# EAGLE design sliding protentiometer (EAGLE 6.1)
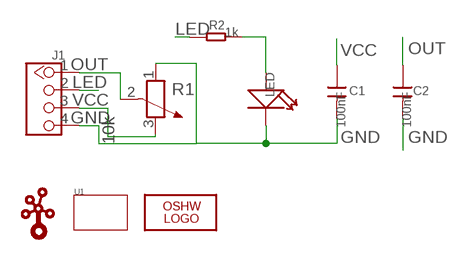
[diagram p0: schematic, sheet 1]

## Parts
C1  100nF  C-0805  [0805]
C2  100nF  C-0805  [0805]
J1  TWIG-4P-2.0-2.0  [4P-2.0]
LED  LED'0805'  [LED-0805]
LOGO1  LOGO-OSHW-FILLX0200-NT  [OSHW_FILLX200_NOTEXT]
R1  10k  R-POTENTIOMETER  [3P-SQUA-45.6X10X5.8H]
R2  1k  R-0805  [0805]
U1  TWIG'3U'  [3U-DIM-W/-DRILL]
U$1  LOGO-TWIG  [TWIGLOGO]

## Nets
GND: C1.2 C2.2 J1.4 LED.- R1.1
LED: J1.2 R2.1
N$5: LED.+ R2.2
OUT: C2.1 J1.1 R1.2
VCC: C1.1 J1.3 R1.3

## Library data of the parts
C1 C2 = Discrete:C*: Ceramic Capacitors
J1 = Connector:TWIG-4P-2.0
LED = Discrete:LED*
LOGO1 = Logo:LOGO-OSHW-FILL
R1 = Discrete:R-POTENTIOMETER*: Potentiometer
R2 = Discrete:R*
U1 = Module:TWIG
U$1 = Logo:LOGO-TWIG

## Board
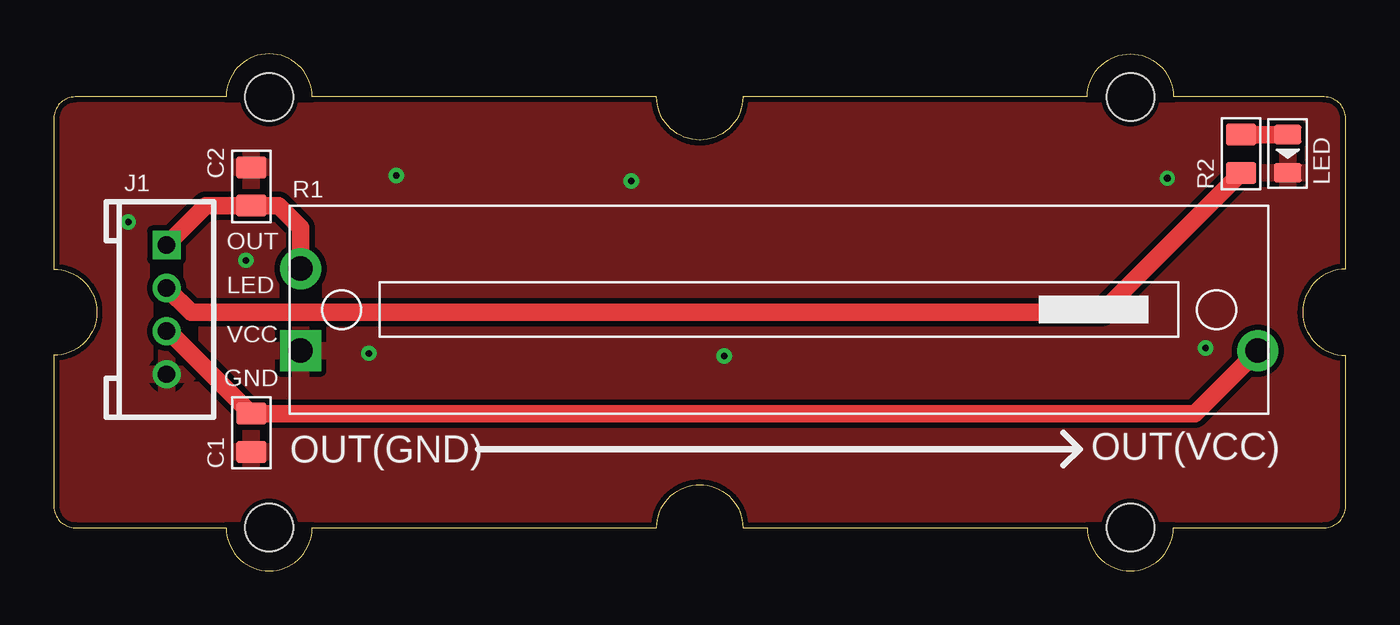
[diagram p1: board, top side]
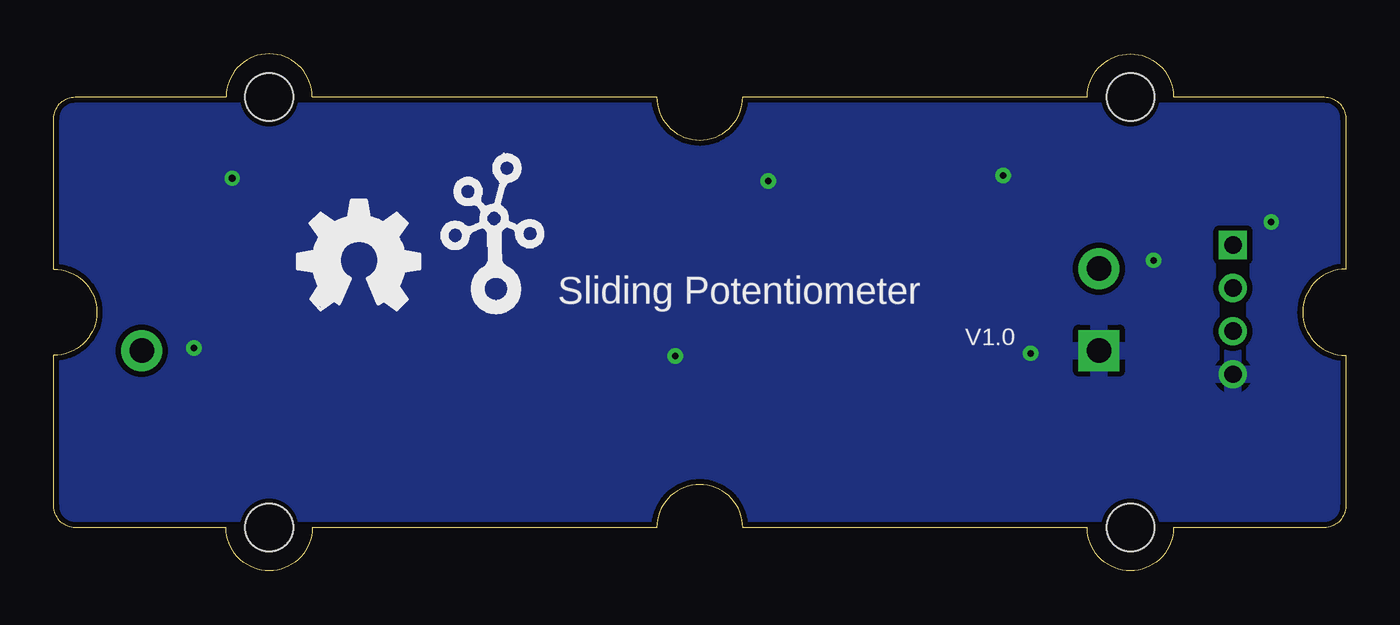
[diagram p2: board, bottom side, seen from below]

Size 60 x 24 mm. Coordinates in mm from the lower left corner, seen from the top.
Copper layers (1*16): Top 0.035mm / dielectric 1.5mm / Bottom 0.035mm
Design rules: minimum track width 6mil, minimum drill 12mil, track to track 6mil, track to pad 6mil, pad to pad 6mil, via to via 6mil, smd to smd 6mil, copper to edge 10mil, drill to drill 10mil, minimum pad ring 10mil, minimum via ring 8mil, stop-mask expansion 2mil, vias tented up to drill 100mil, thermal gap 10mil

### Footprints (pad centres in the part's own frame; a part is rotated, then mirrored left to right if it is on the bottom)
0805 = smd 1.016 x 1.397: 1 -0.889,0; 2 0.889,0
4P-2.0 = drill 0.8 pad 1.27 square: 1 -3,0 | drill 0.8 pad 1.27: 2 -1,0; 3 1,0; 4 3,0
LED-0805 = smd 0.889 x 1.27: + -0.889,0; - 0.889,0
3P-SQUA-45.6X10X5.8H = drill 1.143 pad 1.905 square: 1 -22.225,-1.905 | drill 1.143 pad 1.905: 2 -22.225,1.905; 3 22.225,-1.905
3U-DIM-W/-DRILL = hole 2.2: -20,10; -20,-10; 20,10; 20,-10

### Placement (x,y rotation side)
C1  9.17,6.41 270 top
C2  9.17,17.84 90 top
J1  5.23,12.13 270 top
LED  57.3,19.37 270 top
LOGO1  48.67,12.13 0 bottom
R1  33.68,12.13 0 top
R2  55.15,19.37 90 top
U1  30,12 0 top
U$1  39.52,12.89 0 bottom

### Tracks (layer width: path | path; a pad name or v marks a point on that pad's centre or on a via)
GND  (via drill 0.3 pad 0.64)
  other vias: 51.72,18.22 53.5,10.35 31.14,9.97 26.83,18.1 15.9,18.35 14.63,10.1 3.46,16.19 8.92,14.41
  pour Bottom (isolate 0.254): -3.15,25.08 -3.15,-2.86 62.89,-2.86 62.89,-1.59 62.89,26.35 -3.15,26.35
  pour Top (isolate 0.254): -0.61,-1.59 61.62,-1.59 61.62,25.08 -1.88,25.08 -1.88,-1.59
LED
  Top 0.813: J1.2 5.25,13.13 6.38,12 48.67,12 R2.1
N$5
  Top 0.813: R2.2 LED.+
OUT
  Top 0.813: R1.2 11.46,15.94 10.44,16.95 C2.1 7.06,16.95 J1.1
VCC
  Top 0.813: J1.3 5.35,11.13 C1.1 52.99,7.3 R1.3

### Text on the board
tPlace: OUT(VCC) | OUT(GND)
bPlace: Sliding Potentiometer | V1.0
tNames: OUT | LED | VCC | GND